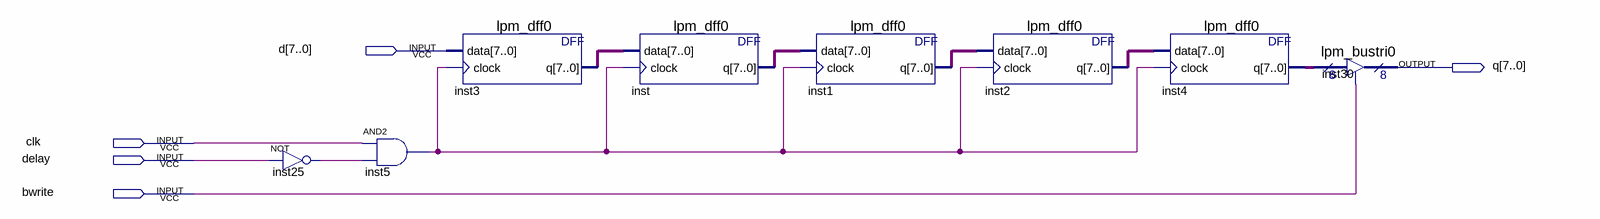
[diagram p0: schematic sheet]
// Quartus schematic register0.bdf as structural Verilog: 8 symbols, 5 pins
module register0 (
  input  [7:0] d,
  input  clk,
  input  delay,
  input  bwrite,
  output [7:0] q
);

  wire inst5_out, inst25_out;
  wire [7:0] inst1_q, inst2_q, inst3_q, inst4_q, inst_q;

  not inst25 (inst25_out, delay);
  and inst5 (inst5_out, clk, inst25_out);
  lpm_dff0 inst3 (.data(d), .clock(inst5_out), .q(inst3_q));
  lpm_dff0 inst (.data(inst3_q), .clock(inst5_out), .q(inst_q));
  lpm_dff0 inst1 (.data(inst_q), .clock(inst5_out), .q(inst1_q));
  lpm_dff0 inst2 (.data(inst1_q), .clock(inst5_out), .q(inst2_q));
  lpm_dff0 inst4 (.data(inst2_q), .clock(inst5_out), .q(inst4_q));
  lpm_bustri0 inst30 (.enabledt(bwrite), .data(inst4_q), .tridata(q));
endmodule
